# EAGLE design BSPD (1) (EAGLE 9.5.0)
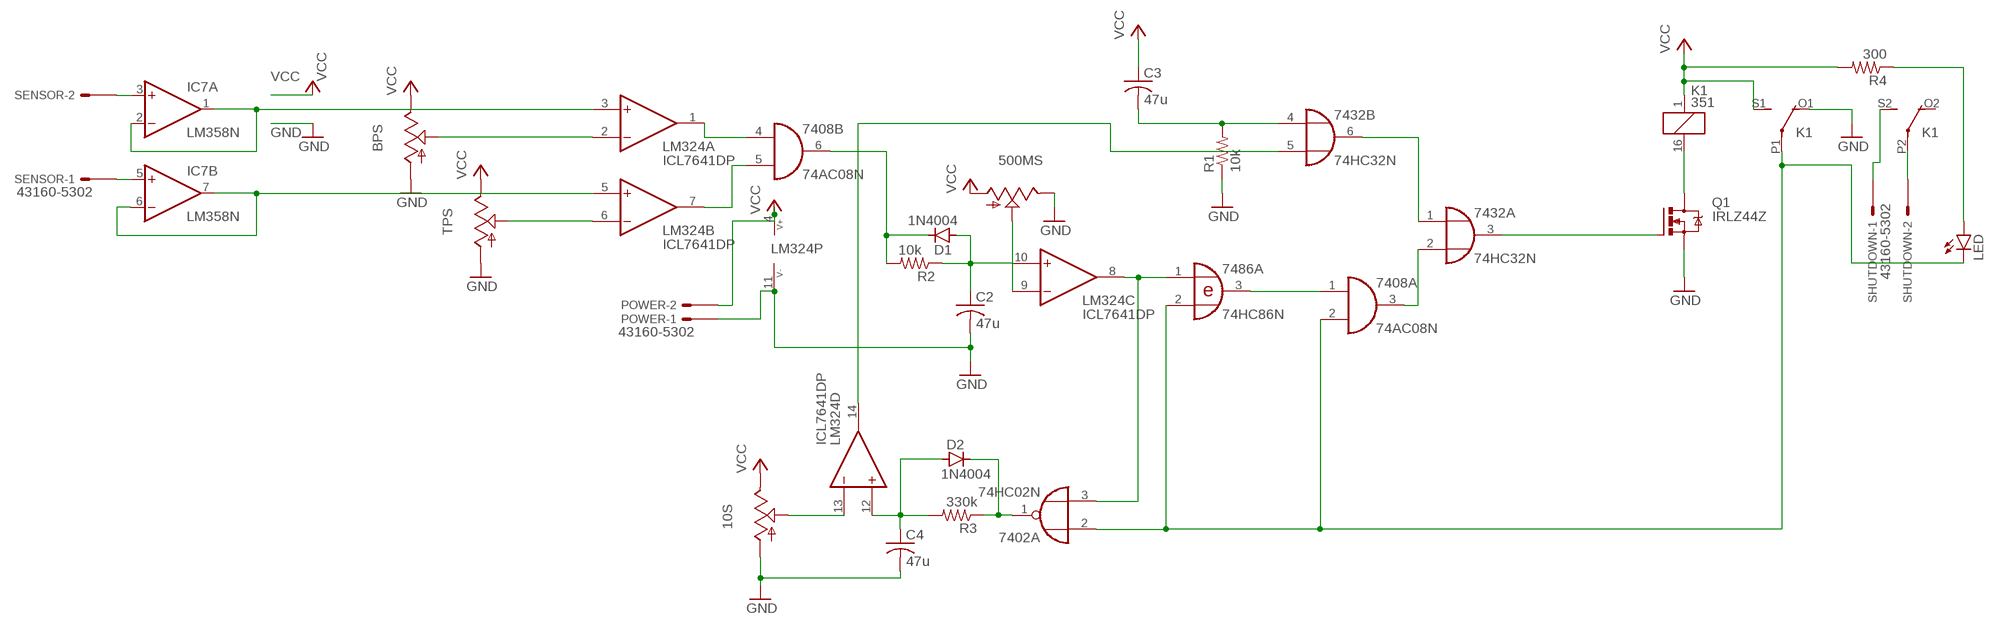
[diagram p0: schematic, sheet 1]

## Parts
10S  TRIM  [6MM]
500MS  TRIM  [6MM]
7402  74HC02N  [DIL14]
7408  74AC08N  [DIL14]
7432  74HC32N  [DIL14]
7486  74HC86N  [DIL14]
BPS  TRIM  [6MM]
C2  47u  C-US025-024X044  [C025-024X044]
C3  47u  C-US025-024X044  [C025-024X044]
C4  47u  C-US025-024X044  [C025-024X044]
D1  1N4004  [DO41-10]
D2  1N4004  [DO41-10]
IC7  LM358N  [DIL08]
K1  351  [351]
LED  LEDCHIP-LED0805  [CHIP-LED0805]
LM324  ICL7641DP  [DIL14]
POWER  43160-5302  [43160-XX02]
Q1  IRLZ44Z  [TO220BH]
R1  10k  R-US_M0805  [M0805]
R2  10k  R-US_M0805  [M0805]
R3  330k  R-US_M0805  [M0805]
R4  300  R-US_M0805  [M0805]
SENSOR  43160-5302  [43160-XX02]
SHUTDOWN  43160-5302  [43160-XX02]
TPS  TRIM  [6MM]

## Nets
GND: 10S.A 500MS.E BPS.A C2.2 C4.2 K1.O1(2:O) LM324.11(P:V-) POWER.1@1(-1:S) Q1.S R1.1 TPS.A
N$2: BPS.S LM324.2(A:-IN)
N$3: LM324.6(B:-IN) TPS.S
N$4: LED.A R4.1
N$5: 7408.4(B:I0) LM324.1(A:OUT)
N$6: 7408.5(B:I1) LM324.7(B:OUT)
N$7: 7408.6(B:O) D1.C R2.2
N$8: C2.1 D1.A LM324.10(C:+IN) R2.1
N$9: 500MS.S LM324.9(C:-IN)
N$10: 7402.3(A:I1) 7486.1(A:I0) LM324.8(C:OUT)
N$11: 7408.1(A:I0) 7486.3(A:O)
N$12: 7408.3(A:O) 7432.2(A:I1)
N$13: 7432.4(B:I0) C3.2 R1.2
N$14: 7432.1(A:I0) 7432.6(B:O)
N$15: 7432.3(A:O) Q1.G
N$16: K1.16 Q1.D
N$17: 10S.S LM324.13(D:-IN)
N$18: C4.1 D2.A LM324.12(D:+IN) R3.2
N$19: 7402.1(A:O) D2.C R3.1
N$20: K1.P2(3:P) SHUTDOWN.2@1(-2:S)
N$22: K1.S2(3:S) SHUTDOWN.1@1(-1:S)
N$24: 7432.5(B:I1) LM324.14(D:OUT)
N$28: 7402.2(A:I0) 7408.2(A:I1) 7486.2(A:I1) K1.P1(2:P) LED.C
N$34: IC7.3(A:+IN) SENSOR.2@1(-2:S)
N$35: IC7.5(B:+IN) SENSOR.1@1(-1:S)
N$36: IC7.1(A:OUT) IC7.2(A:-IN) LM324.3(A:+IN)
N$37: IC7.6(B:-IN) IC7.7(B:OUT) LM324.5(B:+IN)
VCC: 10S.E 500MS.A BPS.E C3.1 K1.1 K1.S1(2:S) LM324.4(P:V+) POWER.2@1(-2:S) R4.2 TPS.E
Unconnected: 7402.4(B:O) 7402.5(B:I0) 7402.6(B:I1) 7402.8(C:I0) 7402.9(C:I1) 7402.10(C:O) 7402.11(D:I0) 7402.12(D:I1) 7402.13(D:O) 7408.8(C:O) 7408.9(C:I0) 7408.10(C:I1) 7408.11(D:O) 7408.12(D:I0) 7408.13(D:I1) 7432.8(C:O) 7432.9(C:I0) 7432.10(C:I1) 7432.11(D:O) 7432.12(D:I0) 7432.13(D:I1) 7486.4(B:I0) 7486.5(B:I1) 7486.6(B:O) 7486.8(C:O) 7486.9(C:I0) 7486.10(C:I1) 7486.11(D:O) 7486.12(D:I0) 7486.13(D:I1) K1.O2(3:O) POWER.1@2(-1:S) POWER.2@2(-2:S) SENSOR.1@2(-1:S) SENSOR.2@2(-2:S) SHUTDOWN.1@2(-1:S) SHUTDOWN.2@2(-2:S)

## Power pins joined to a net without a drawn wire
GND: 7402.7(P:GND) 7408.7(P:GND) 7432.7(P:GND) 7486.7(P:GND) IC7.4(P:V-)
VCC: 7402.14(P:VCC) 7408.14(P:VCC) 7432.14(P:VCC) 7486.14(P:VCC) IC7.8(P:V+)

## Library data of the parts
10S 500MS BPS TPS = adafruit:TRIM
7402 = 74xx-eu:74*02: Quad 2-input NOR gate
7408 = 74xx-eu:74*08: Quad 2-input AND gate
7432 = 74xx-eu:74*32: Quad 2-input OR gate
7486 = 74xx-eu:74*86: Quad 2-input EXCLUSIVE-OR (XOR) gate
C2-C4 = adafruit:C-US: CAPACITOR, American symbol
D1 D2 = diode:1N4004: DIODE general purpose rectifier, 1 A
IC7 = linear:LM358: OP AMP also LM158; LM258; LM2904 Source: http://cache.national.com/ds/LM/LM158.pdf
K1 = relay:351: RELAY 2 x switch, Omron; OC_FARNELL: unknown; OC_NEWARK: unknown
LED = led:LED: LED OSRAM: - CHIPLED LG R971, LG N971, LY N971, LG Q971, LY Q971, LO R971, LY R971 LH N974, LH R974 LS Q976, LO Q976, LY Q976 LO Q996 - Hyper CHIPLED LW Q18S LB Q993, LB Q99A, LB R99A - SideLED LS A670, LO A670, LY A670, LG A670, LP A670 LB A673, LV A673, LT A673, LW A673 LH A674 LY A675 LS A676, LA A676, LO A676, LY A676, LW A676 LS A679, LY A679, LG A679 - Hyper Micro SIDELED® LS Y876, LA Y876, LO Y876, LY Y876 LT Y87S - SmartLED LW L88C, LW L88S LB L89C, LB L89S, LG L890 LS L89K, LO L89K, LY L89K LS L896, LA L896, LO L896, LY L896 - TOPLED LS T670, LO T670, LY T670, LG T670, LP T670 LSG T670, LSP T670, LSY T670, LOP T670, LYG T670 LG T671, LOG T671, LSG T671 LB T673, LV T673, LT T673, LW T673 LH T674 LS T676, LA T676, LO T676, LY T676, LB T676, LH T676, LSB T676, LW T676 LB T67C, LV T67C, LT T67C, LS T67K, LO T67K, LY T67K, LW E67C LS E67B, LA E67B, LO E67B, LY E67B, LB E67C, LV E67C, LT E67C LW T67C LS T679, LY T679, LG T679 LS T770, LO T770, LY T770, LG T770, LP T770 LB T773, LV T773, LT T773, LW T773 LH T774 LS E675, LA E675, LY E675, LS T675 LS T776, LA T776, LO T776, LY T776, LB T776 LHGB T686 LT T68C, LB T68C - Hyper Mini TOPLED® LB M676 - Mini TOPLED Santana® LG M470 LS M47K, LO M47K, LY M47K Source: http://www.osram.convergy.de LUXEON: - LUMILED® LXK2-PW12-R00, LXK2-PW12-S00, LXK2-PW14-U00, LXK2-PW14-V00 LXK2-PM12-R00, LXK2-PM12-S00, LXK2-PM14-U00 LXK2-PE12-Q00, LXK2-PE12-R00, LXK2-PE12-S00, LXK2-PE14-T00, LXK2-PE14-U00 LXK2-PB12-K00, LXK2-PB12-L00, LXK2-PB12-M00, LXK2-PB14-N00, LXK2-PB14-P00, LXK2-PB14-Q00 LXK2-PR12-L00, LXK2-PR12-M00, LXK2-PR14-Q00, LXK2-PR14-R00 LXK2-PD12-Q00, LXK2-PD12-R00, LXK2-PD12-S00 LXK2-PH12-R00, LXK2-PH12-S00 LXK2-PL12-P00, LXK2-PL12-Q00, LXK2-PL12-R00 Source: www.luxeon.com KINGBRIGHT: KA-3528ASYC Source: www.kingbright.com
LM324 = maxim:ICL764*: Quad Operational Amplifiers Source: http://datasheets.maxim-ic.com/en/ds/ICL7612-ICL764X.pdf; OC_FARNELL: unknown; OC_NEWARK: unknown
POWER SENSOR SHUTDOWN = con-molex:43160-*02: SDA-43160 Connector Source: http://www.molex.com/pdm_docs/sd/431601306_sd.pdf; MF: MOLEX; MPN: 43160-5302; OC_FARNELL: unknown; OC_NEWARK: 92M1498
Q1 = transistor-power:IRLZ44Z: N-Channel HEXFET® Power MOSFET Logic Level AUTOMOTIVE MOSFET Source: http://www.irf.com/product-info/datasheets/data/irlz44zpbf.pdf
R1-R4 = rcl:R-US_: RESISTOR, American symbol; SPICEPREFIX: R

## Board
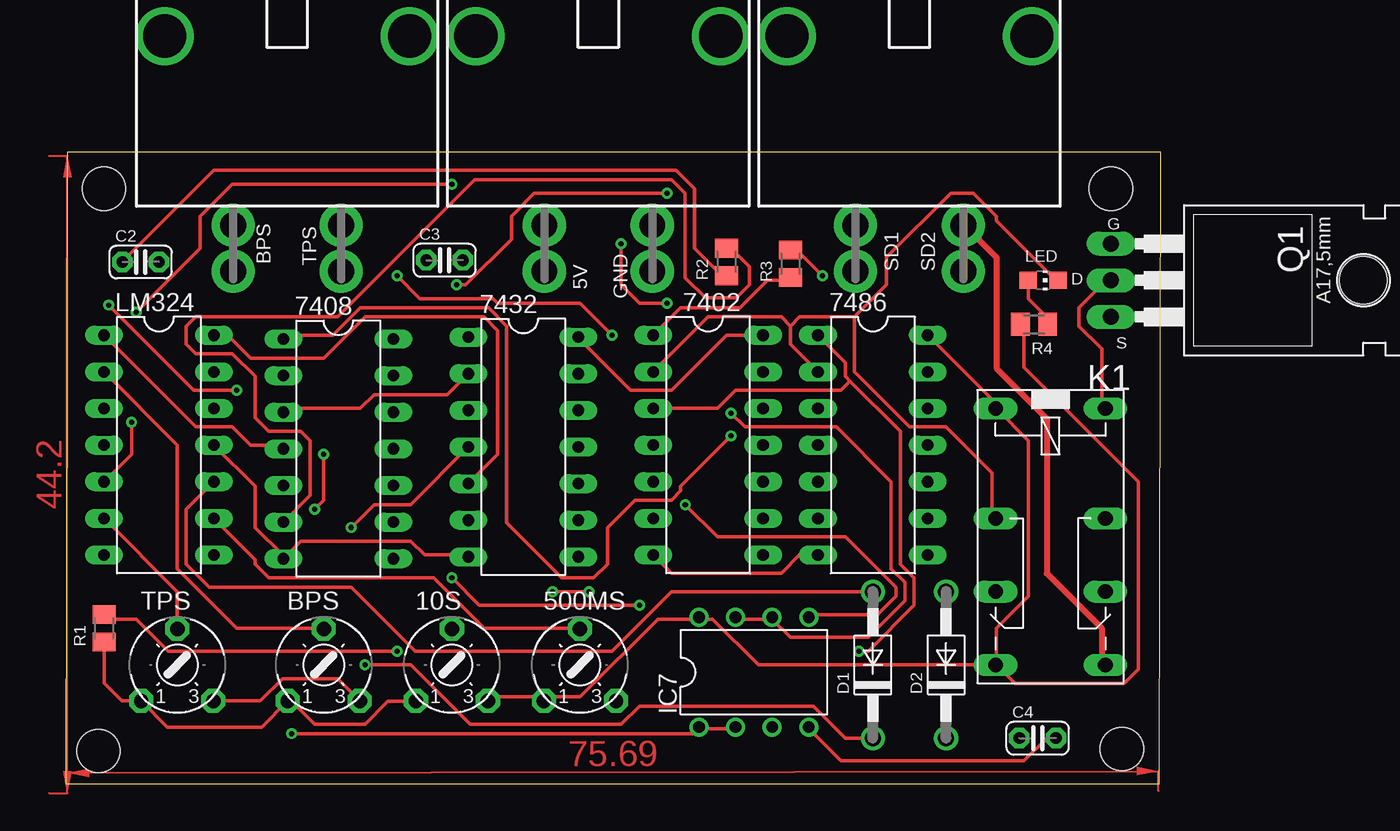
[diagram p1: board, top side]
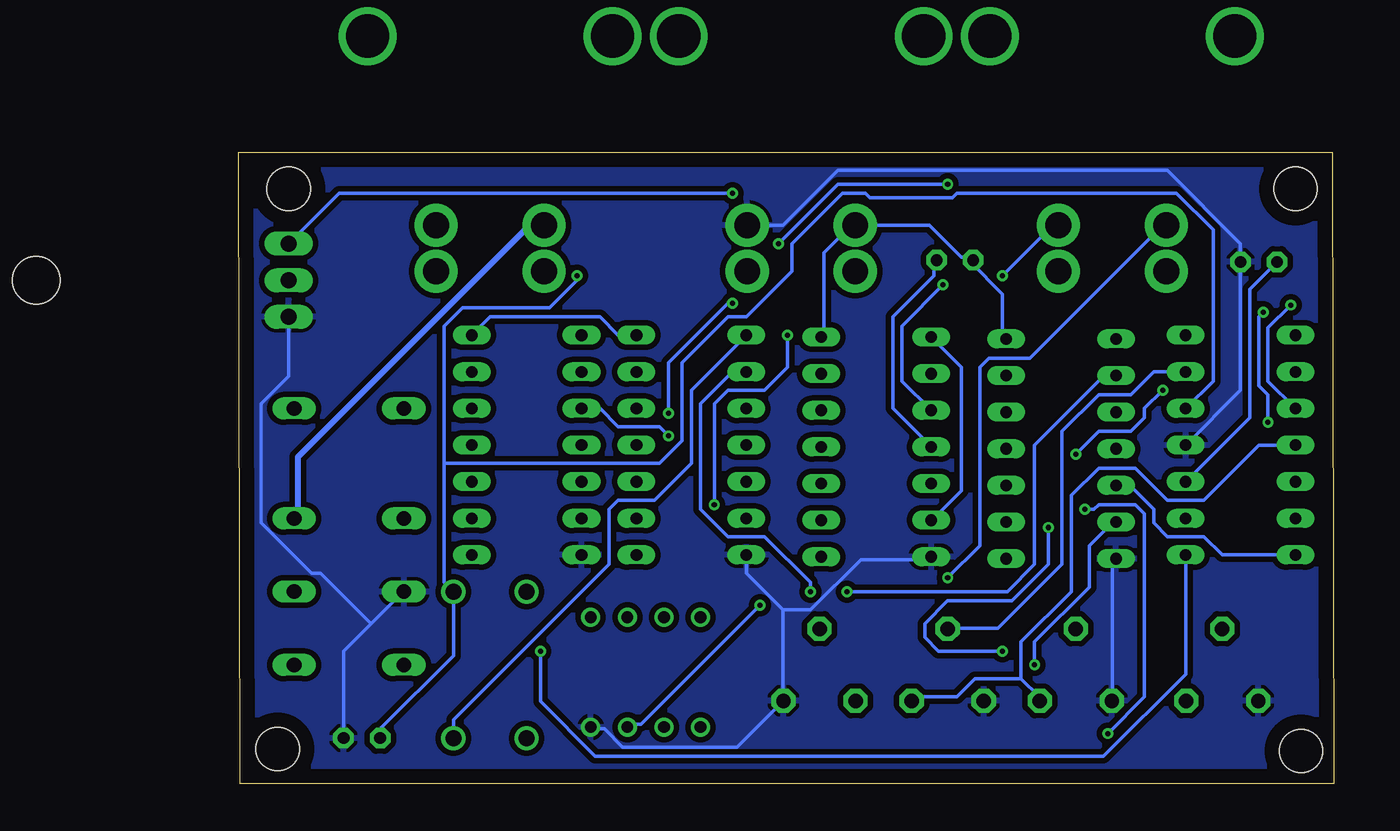
[diagram p2: board, bottom side, seen from below]

Size 76 x 43.81 mm. Coordinates in mm from the lower left corner, seen from the top.
Outline: 0,0 75.87,0 76,43.81 0.13,43.81 0,0
Copper layers (1*16): Top 0.035mm / dielectric 1.5mm / Bottom 0.035mm
Design rules "default *": minimum track width 10mil, minimum drill 0.35mm, track to track 15mil, track to pad 15mil, pad to pad 15mil, via to via 15mil, smd to smd 15mil, copper to edge 40mil, drill to drill 6mil, minimum pad ring 10mil, minimum via ring 8mil, stop-mask expansion 4mil, vias tented up to drill 0mil, thermal gap 10mil
Holes 3 mm at 2.29,2.29 72.52,41.28 2.67,41.28 73.28,2.41

### Footprints (pad centres in the part's own frame; a part is rotated, then mirrored left to right if it is on the bottom)
6MM = drill 1 pad 1.676 octagon: A -2.5,-2.5; E 2.5,-2.5; S 0,2.5
DIL14 = drill 0.813 long: 1 -7.62,-3.81; 2 -5.08,-3.81; 3 -2.54,-3.81; 4 0,-3.81; 5 2.54,-3.81; 6 5.08,-3.81; 7 7.62,-3.81; 8 7.62,3.81; 9 5.08,3.81; 10 2.54,3.81; 11 0,3.81; 12 -2.54,3.81; 13 -5.08,3.81; 14 -7.62,3.81
C025-024X044 = drill 0.813 pad 1.422 octagon: 1 -1.27,0; 2 1.27,0
DO41-10 = drill 1.118: A 5.08,0; C -5.08,0
DIL08 = drill 0.813 pad 1.27: 1 -3.81,-3.81; 2 -1.27,-3.81; 3 1.27,-3.81; 4 3.81,-3.81; 5 3.81,3.81; 6 1.27,3.81; 7 -1.27,3.81; 8 -3.81,3.81
351 = drill 1.016 long: 1 -3.81,-3.81; 16 -3.81,3.81; O1 8.89,-3.81; O2 8.89,3.81; P1 3.81,-3.81; P2 3.81,3.81; S1 13.97,-3.81; S2 13.97,3.81
CHIP-LED0805 = smd 1.2 x 1.2: A 0,-1.05; C 0,1.05
43160-XX02 = drill 1.8 pad 3: 1@1 -3.745,0; 1@2 -3.745,3.18; 2@1 3.745,0; 2@2 3.745,3.18 | drill 3 pad 3.4: M1 -8.495,-13.13; M2 8.495,-13.13
TO220BH = drill 1.118 long: D 0,-6.35; G -2.54,-6.35; S 2.54,-6.35 | hole 3.302: 0,11.176
M0805 = smd 1.3 x 1.6: 1 -0.95,0; 2 0.95,0

### Placement (x,y rotation side)
10S  26.8,8.26 0 top
500MS  35.69,8.26 0 top
7402  44.58,23.49 270 top
7408  18.92,23.24 270 top
7432  31.75,23.37 270 top
7486  56.01,23.49 270 top
BPS  17.91,8.26 0 top
C2  5.21,36.2 0 top
C3  26.29,36.32 0 top
C4  67.44,3.17 0 top
D1  56.01,8.26 90 top
D2  61.09,8.26 90 top
IC7  47.75,7.75 0 top
K1  68.33,22.23 270 top
LED  67.82,34.92 270 top
LM324  6.48,23.49 270 top
POWER  36.96,38.73 180 top
Q1  78.87,34.92 270 top
R1  2.67,10.8 90 top
R2  45.85,36.2 90 top
R3  50.29,36.07 90 top
R4  67.18,31.88 180 top
SENSOR  15.37,38.73 180 top
SHUTDOWN  58.55,38.73 180 top
TPS  7.75,8.26 0 top

### Tracks (layer width: path | path; a pad name or v marks a point on that pad's centre or on a via)
GND
  Top 0.254: 7486.7 50.93,15.88 49.66,14.61 42.04,14.61 7402.7 | LM324.11 13.15,20.64 13.15,17.78 15.05,15.88 7408.7 16.32,16.83 23.94,16.83 24.89,15.88 27.75,15.88 7432.7 | 10S.A 24.26,5.72 22.35,5.72 20.76,4.13 17.27,4.13 15.68,5.72 BPS.A 13.59,3.94 7.06,3.94 TPS.A | C4.2 68.07,3.17 66.48,1.59 53.78,1.59 51.56,3.81 IC7.4 | R1.1 2.67,8.26 2.67,6.98 3.9,5.76 TPS.A | TPS.A 5.25,5.67
  Bottom 0.254: C4.2 68.71,9.21 66.8,11.11 | 66.8,11.11 64.58,13.34 K1.O1 | Q1.S 72.52,28.26 74.42,26.35 74.42,18.1 70.93,14.61 70.3,14.61 66.8,11.11 | 7402.7 40.77,14.61 38.23,12.06 | 38.23,12.06 38.23,6.03 500MS.E 41.4,2.54 49.34,2.54 50.61,3.81 51.56,3.81 IC7.4 | LM324.11 6.48,27.31 C2.2 6.48,37.47 11.56,42.55 34.42,42.55 38.23,38.73 POWER.1@1 | BPS.A 15.37,6.03 15.37,15.56 7408.7 | 38.23,12.06 36.32,12.06 32.83,15.56 28.07,15.56 7432.7
  pour Bottom: 0,43.69 0,0.13 75.82,0.13 75.82,43.69
N$2
  Top 0.254: LM324.2 7.75,23.49 7.75,14.92 11.88,10.8 17.91,10.8 BPS.S
N$3
  Top 0.254: LM324.6 7.75,13.34 TPS.S
N$4
  Top 0.254: LED.A 66.8,34.92 66.8,33.66 68.39,32.07 R4.1
N$5
  Top 0.254: LM324.1 9.02,24.77 11.56,24.77 12.83,23.49 15.05,23.49 7408.4
N$6
  Bottom 0.254: LM324.7 7.75,15.88 9.02,17.15 11.56,17.15 12.51,18.1 12.51,19.05 14.1,20.64 15.05,20.64 7408.5
N$7  (via drill 0.35)
  Top 0.254: 7408.6 16.95,20 16.95,23.81 16.32,24.45 14.1,24.45 13.15,25.4 13.15,28.26 11.56,29.84 9.02,29.84 8.38,30.48 8.38,31.75 9.02,32.39 18.86,32.39 28.38,41.91 42.04,41.91 42.99,40.96 42.99,35.11 44.39,33.72 46.55,33.72 47.43,34.61 47.43,35.88 46.48,36.83 45.85,36.83 R2.2 | D1.C 54.1,3.17 51.88,5.4 39.82,5.4 38.54,4.13 28.07,4.13 23.94,8.26 v20.76,8.26
  Bottom 0.254: v20.76,8.26 20.76,9.84 16.95,13.65 16.95,16.51 15.37,18.1 7408.6
N$8
  Top 0.254: C2.1 10.29,42.55 42.35,42.55 43.62,41.28 43.62,37.15 45.21,35.56 45.85,35.56 R2.1 | D1.A 42.04,13.34 37.91,9.21 24.26,9.21 19.81,13.65 9.97,13.65 8.38,15.24 8.38,19.05 LM324.10
  Bottom 0.254: LM324.10 5.84,25.4 5.84,34.29 C2.1
N$9
  Top 0.254: LM324.9 13.15,15.56 13.15,15.24 14.1,14.29 25.53,14.29 29.02,10.8 35.69,10.8 500MS.S
N$10  (via drill 0.35)
  Top 0.254: v55.05,9.21 55.69,9.21 58.86,12.38 58.86,14.29 57.91,15.24 57.91,24.45 54.42,27.94 | 54.42,27.94 54.1,28.26 54.1,29.21 7486.1 | 7402.3 45.21,26.03 46.48,27.31 53.78,27.31 54.42,27.94
  Bottom 0.254: LM324.8 10.29,7.62 16,1.91 51.24,1.91 55.05,5.72 v55.05,9.21
N$11  (via drill 0.35)
  Top 0.254: v46.16,24.13 42.67,20.64 42.67,20.32 42.04,19.69 39.5,19.69 37.59,17.78 37.59,15.24 36.64,14.29 34.42,14.29 30.61,18.1 30.61,31.75 29.34,33.02 20.45,33.02 18.54,31.11 15.37,31.11 7408.1
  Bottom 0.254: 7486.3 50.93,26.03 49.66,24.77 46.8,24.77 v46.16,24.13
N$12
  Top 0.254: 7432.2 26.48,26.99 21.4,26.99 20.45,26.03 15.37,26.03 7408.3
N$13  (via drill 0.35)
  Top 0.254: v22.99,9.21 7.11,9.21 4.89,11.43 2.67,11.43 R1.2 | v19.81,17.78 21.4,19.37 23.94,19.37 7432.4
  Bottom 0.254: v22.99,9.21 27.43,9.21 28.38,10.16 28.38,11.11 26.8,12.7 22.35,12.7 19.81,15.24 v19.81,17.78 | 7432.4 30.61,26.03 30.61,32.39 27.75,35.24 27.75,36.2 C3.2
N$14
  Bottom 0.254: 7432.1 25.84,28.89 25.84,20.32 27.75,18.41 7432.6
N$15  (via drill 0.35)
  Top 0.254: v27.11,34.61 27.75,34.61 30.92,37.78 30.92,39.37 32.51,40.96 v41.72,40.96
  Bottom 0.254: 7432.3 29.97,27.94 29.97,31.75 v27.11,34.61 | v41.72,40.96 69.02,40.96 Q1.G
N$16
  Top 0.254: Q1.D 72.2,34.92 70.3,33.02 70.3,31.75 71.88,30.16 71.88,26.03 K1.16
N$17
  Bottom 0.254: LM324.13 12.51,28.58 14.1,26.99 16.32,26.99 18.86,24.45 18.86,15.24 23.3,10.8 26.8,10.8 10S.S
N$18  (via drill 0.35)
  Top 0.254: v52.52,35.24 50.93,36.83 50.29,36.83 R3.2
  Bottom 0.254: v52.52,35.24 52.52,34.92 54.42,33.02 60.45,33.02 61.72,31.75 61.72,22.23 | 61.72,22.23 61.72,13.97 D2.A 61.09,8.89 66.17,3.81 C4.1 | LM324.12 8.38,27.94 8.38,38.42 10.92,40.96 26.16,40.96 26.48,40.64 32.2,40.64 32.51,40.96 34.1,40.96 37.59,37.47 37.59,35.56 40.77,32.39 42.04,32.39 45.21,29.21 45.21,23.81 46.8,22.23 61.72,22.23
N$19
  Top 0.254: 7402.1 42.67,33.02 46.8,33.02 48.71,34.92 50.29,34.92 R3.1
  Bottom 0.254: D2.C 61.09,4.45 50.29,15.24 50.29,19.05 49.66,19.69 47.12,19.69 44.58,22.23 44.58,27.31 7402.1
N$20
  Bottom 0.254: SHUTDOWN.2@1 55.82,38.73
  Bottom 0.406: 55.82,38.73 71.88,22.67 71.88,18.41 K1.P2
N$22
  Top 0.406: K1.S2 71.88,8.26 71.88,10.8 68.07,14.61 68.07,25.34 64.58,28.83 64.58,36.51 62.36,38.73 SHUTDOWN.1@1
N$24
  Top 0.254: 7432.5 29.97,22.86 29.97,31.43 29.02,32.39 20.76,32.39 17.91,29.53 12.83,29.53 11.24,31.11 LM324.14
N$28  (via drill 0.35)
  Top 0.254: 54.74,32.39 56.96,34.61 56.96,36.51 61.41,40.96 62.99,40.96 64.58,39.37 64.58,39.05 68.71,34.92 LED.C | 54.74,32.39 50.93,32.39 50.29,31.75 | 50.29,31.75 50.29,30.48 7486.2 | 54.74,32.39 54.74,28.58 58.55,24.77 61.09,24.77 64.26,21.59 64.26,18.41 K1.P1 | v36.32,13.34 v33.78,13.34 | 50.29,31.75 49.66,32.39 44.58,32.39 7402.2
  Bottom 0.254: v33.78,13.34 22.67,13.34 20.76,15.24 20.76,23.49 16,28.26 15.37,28.26 7408.2 | v36.32,13.34 36.32,13.97 39.5,17.15 42.04,17.15 43.94,19.05 43.94,26.35 41.72,28.58 7402.2
N$34  (via drill 0.35)
  Top 0.254: v39.82,12.38 28.7,12.38 v26.8,14.29
  Bottom 0.254: v39.82,12.38 48.07,4.13 49.02,4.13 IC7.3 | v26.8,14.29 24.57,16.51 24.57,28.89 23.94,29.53 21.08,29.53 11.88,38.73 SENSOR.2@1
N$35  (via drill 0.35)
  Top 0.254: v42.99,19.37 45.21,17.15 54.1,17.15 57.6,13.65 57.6,13.02 56.32,11.75 51.75,11.75 IC7.5 | v37.91,31.11 35.69,33.34 29.97,33.34 29.65,33.66 24.57,33.66 v22.99,35.24
  Bottom 0.254: v42.99,19.37 42.99,26.35 42.04,27.31 39.5,27.31 37.91,28.89 v37.91,31.11 | v22.99,35.24 19.49,38.73 SENSOR.1@1
N$36  (via drill 0.35)
  Top 0.254: 43.94,3.81 46.48,3.81 IC7.2 | v2.98,33.21 8.89,27.31 v11.88,27.31 | v17.91,22.86 17.91,19.69 v17.27,19.05 | v15.68,3.49 43.62,3.49 43.94,3.81 | 43.94,3.81 IC7.1
  Bottom 0.254: LM324.3 4.57,27.94 4.57,31.62 v2.98,33.21 | v11.88,27.31 13.15,26.03 13.15,25.4 14.1,24.45 16.32,24.45 v17.91,22.86 | v17.27,19.05 16.64,19.05 16.32,19.37 13.78,19.37 13.15,18.73 13.15,6.03 v15.68,3.49
N$37  (via drill 0.35)
  Top 0.254: 49.02,11.43 46.48,11.43 IC7.7 | LM324.5 4.57,22.86 v4.57,25.08 | v4.89,32.7 9.33,37.15 9.33,39.37 11.56,41.59 v26.8,41.59 | v38.54,37.47 38.54,34.61 39.82,33.34 v41.72,33.34 | v46.16,25.72 47.12,24.77 53.47,24.77 57.28,20.95 57.28,14.92 58.23,13.97 58.23,12.7 55.69,10.16 50.29,10.16 49.02,11.43 | 49.02,11.43 IC7.6
  Bottom 0.254: v4.57,25.08 4.57,26.99 5.21,27.62 5.21,32.39 v4.89,32.7 | v26.8,41.59 34.42,41.59 v38.54,37.47 | v41.72,33.34 42.04,33.34 46.16,29.21 v46.16,25.72
VCC
  Top 0.254: 43.94,11.43 41.09,11.43 35.69,6.03 33.46,6.03 500MS.A 33.15,6.03 29.34,6.03 10S.E | BPS.E 18.86,7.3 15.05,7.3 13.5,5.76 TPS.E | 64.58,8.26 65.85,6.98 73.47,6.98 74.42,7.94 74.42,20.95 66.48,28.89 66.48,31.75 R4.2 | 7486.14 64.26,26.67 64.26,26.03 K1.1 64.58,26.03 66.8,23.81 66.8,13.02 64.58,10.8 64.58,8.26 | 7402.14 45.85,31.11 42.04,27.31 39.18,27.31 35.69,30.8 7432.14 | 64.58,8.26 K1.S1 48.07,8.26 44.89,11.43 43.94,11.43 | 43.94,11.43 IC7.8
  Bottom 0.254: LM324.4 5.21,23.49 9.02,19.69 11.56,19.69 13.78,21.91 16.32,21.91 18.22,20 18.22,13.34 21.72,9.84 21.72,7.3 | 21.72,7.3 20.45,6.03 BPS.E | 21.72,7.3 24.89,7.3 26.16,6.03 29.02,6.03 10S.E | 7402.14 49.66,31.11 50.93,32.39 58.55,32.39 7486.14 | 7408.14 22.99,31.11 22.99,33.97 25.21,36.2 C3.1 25.21,36.51 25.84,36.51 28.07,38.73 POWER.2@1 33.46,38.73 35.37,36.83 35.37,31.11 7432.14
(copper drawn outside any net)
  shapes: Top area x2

### Text on the board
tPlace: G | BPS | TPS | SD1 | SD2 | D | 5V | GND | S